# EAGLE design SocketToLittleBits (EAGLE 7.4.0)
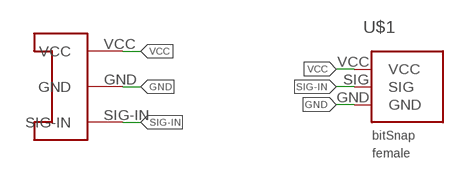
[diagram p0: schematic, sheet 1]

## Parts
U$1  BITSNAP_V03_FEMALE  [BITSNAP_V03_FEMALE]
U$2  CONN-SOCKET-3POS-3MM  [SOCKET-3POS-3MM-SMD]

## Nets
GND: U$1.GND U$2.GND
SIG-IN: U$1.SIG U$2.SIG-IN
VCC: U$1.VCC U$2.VCC

## Library data of the parts
U$1 = bitSnap140813:BITSNAP_V03_FEMALE
U$2 = EmbeddedPlayground:CONN-SOCKET-3POS-3MM: Surface mount board to board connector. Female socket, 3 position.

## Board
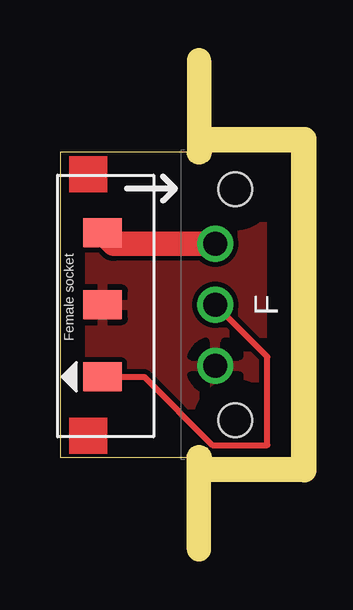
[diagram p1: board, top side]
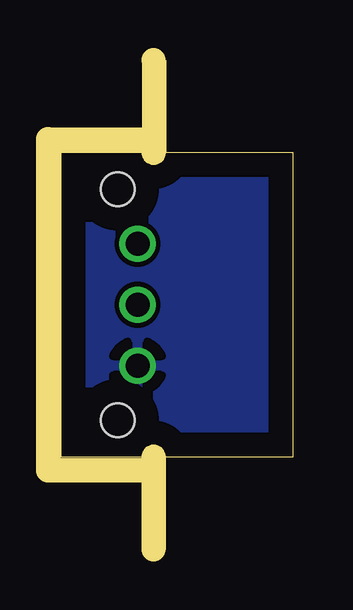
[diagram p2: board, bottom side, seen from below]

Size 9.65 x 12.7 mm. Coordinates in mm from the lower left corner, seen from the top.
Outline: 0,0 9.65,0 9.65,12.7 0,12.7 0,0
Copper layers (1*16): Top 0.035mm / dielectric 1.5mm / Bottom 0.035mm
Design rules "default": minimum track width 10mil, minimum drill 24mil, track to track 8mil, track to pad 8mil, pad to pad 8mil, via to via 8mil, smd to smd 8mil, copper to edge 40mil, drill to drill 8mil, minimum pad ring 10mil, minimum via ring 8mil, stop-mask expansion 4mil, vias tented up to drill 0mil, thermal gap 10mil

### Footprints (pad centres in the part's own frame; a part is rotated, then mirrored left to right if it is on the bottom)
BITSNAP_V03_FEMALE = drill 1: GND 4.065,3.44; SIG 6.605,3.44; VCC 9.145,3.44 | hole 1.4: 1.785,2.61; 11.425,2.61
SOCKET-3POS-3MM-SMD = smd 1.2 x 1.6: GND 0,0; SIG-IN -3,0; VCC 3,0

### Placement (x,y rotation side)
U$1  9.91,-0.25 90 top
U$2  1.78,6.35 90 top

### Tracks (layer width: path | path; a pad name or v marks a point on that pad's centre or on a via)
GND
  pour Top: -10.16,12.19 -10.16,-0.51 18.8,-0.25 18.8,12.45
  pour Bottom: -10.41,12.7 18.8,12.45 18.8,-0.25 -10.41,0
SIG-IN
  Top 0.254: U$2.SIG-IN 3.51,3.35 6.35,0.51 8.64,0.51 8.64,4.18 U$1.SIG
VCC
  Top 1.016: U$1.VCC 2.24,8.89 U$2.VCC